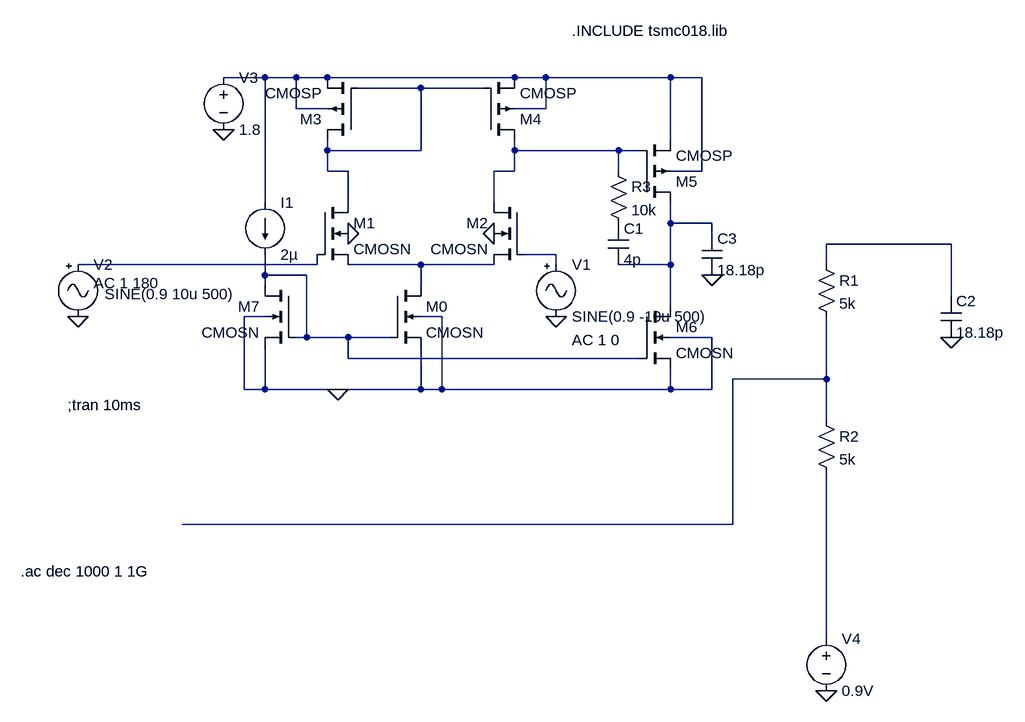
[diagram p0: schematic 2_OTA.asc]
2_OTA.asc, the LTspice schematic file:
Version 4
SHEET 1 1088 804
WIRE -64 -160 -128 -160
WIRE -16 -160 -64 -160
WIRE 32 -160 -16 -160
WIRE 320 -160 32 -160
WIRE 368 -160 320 -160
WIRE 560 -160 368 -160
WIRE 608 -160 560 -160
WIRE 176 -144 80 -144
WIRE 272 -144 176 -144
WIRE -16 -112 -16 -160
WIRE 32 -112 -16 -112
WIRE 368 -112 368 -160
WIRE 368 -112 320 -112
WIRE 560 -64 560 -160
WIRE 32 -48 32 -64
WIRE 176 -48 176 -144
WIRE 176 -48 32 -48
WIRE 320 -48 320 -64
WIRE 480 -48 320 -48
WIRE 512 -48 480 -48
WIRE 32 -16 32 -48
WIRE 64 -16 32 -16
WIRE 320 -16 320 -48
WIRE 320 -16 288 -16
WIRE 480 -16 480 -48
WIRE 608 -16 608 -160
WIRE 608 -16 560 -16
WIRE -64 32 -64 -160
WIRE 64 32 64 -16
WIRE 288 32 288 -16
WIRE 560 64 560 32
WIRE 624 64 560 64
WIRE 624 80 624 64
WIRE 992 96 800 96
WIRE 384 112 336 112
WIRE 16 128 16 112
WIRE 16 128 -352 128
WIRE 176 128 64 128
WIRE 288 128 176 128
WIRE 384 128 384 112
WIRE 560 128 560 64
WIRE 560 128 480 128
WIRE 800 128 800 96
WIRE -64 144 -64 112
WIRE 0 144 -64 144
WIRE -64 160 -64 144
WIRE 176 160 176 128
WIRE 992 176 992 96
WIRE 560 192 560 128
WIRE -64 208 -96 208
WIRE 208 208 176 208
WIRE 0 240 0 144
WIRE 0 240 -16 240
WIRE 64 240 0 240
WIRE 128 240 64 240
WIRE 624 240 560 240
WIRE 64 272 64 240
WIRE 512 272 64 272
WIRE 800 304 800 208
WIRE 800 304 656 304
WIRE -96 320 -96 208
WIRE -64 320 -64 256
WIRE -64 320 -96 320
WIRE 48 320 -64 320
WIRE 176 320 176 256
WIRE 176 320 48 320
WIRE 208 320 208 208
WIRE 208 320 176 320
WIRE 560 320 560 288
WIRE 560 320 208 320
WIRE 624 320 624 240
WIRE 624 320 560 320
WIRE 800 368 800 304
WIRE 656 528 656 304
WIRE 656 528 -192 528
WIRE 800 704 800 448
FLAG 48 320 0
FLAG 64 80 0
FLAG 288 80 0
FLAG -352 208 0
FLAG 384 208 0
FLAG -128 -80 0
FLAG 800 784 0
FLAG 992 240 0
FLAG 624 144 0
SYMBOL cmosn -16 160 M0
SYMATTR InstName M7
SYMATTR Value2 l=1u w=2u
SYMBOL cmosn 336 32 M0
SYMATTR InstName M2
SYMATTR Value2 l=1u w=2.1739u
SYMBOL cmosn 16 32 R0
SYMATTR InstName M1
SYMATTR Value2 l=1u w=2.1739u
SYMBOL cmosp 272 -64 M180
SYMATTR InstName M4
SYMATTR Value2 l=1u w=1.314u
SYMBOL cmosp 80 -64 R180
SYMATTR InstName M3
SYMATTR Value2 l=1u w=1.314u
SYMBOL current -64 32 R0
WINDOW 123 0 0 Left 2
WINDOW 39 0 0 Left 2
SYMATTR InstName I1
SYMATTR Value 2µ
SYMBOL Misc\\signal -352 112 R0
WINDOW 3 41 61 Left 2
WINDOW 123 24 44 Left 2
WINDOW 39 0 0 Left 2
SYMATTR Value SINE(0.9 10u 500)
SYMATTR Value2 AC 1 180
SYMATTR InstName V2
SYMBOL cmosn 512 192 R0
SYMATTR InstName M6
SYMATTR Value2 l=1u w=80u
SYMBOL cmosp 512 32 M180
SYMATTR InstName M5
SYMATTR Value2 l=1u w=10.512u
SYMBOL Misc\\signal 384 112 R0
WINDOW 123 24 132 Left 2
WINDOW 39 0 0 Left 2
SYMATTR Value2 AC 1 0
SYMATTR InstName V1
SYMATTR Value SINE(0.9 -10u 500)
SYMBOL voltage -128 -176 R0
WINDOW 123 0 0 Left 2
WINDOW 39 0 0 Left 2
SYMATTR InstName V3
SYMATTR Value 1.8
SYMBOL res 784 112 R0
SYMATTR InstName R1
SYMATTR Value 5k
SYMBOL res 784 352 R0
SYMATTR InstName R2
SYMATTR Value 5k
SYMBOL voltage 800 688 R0
WINDOW 123 0 0 Left 2
WINDOW 39 0 0 Left 2
SYMATTR InstName V4
SYMATTR Value 0.9V
SYMBOL cap 976 176 R0
SYMATTR InstName C2
SYMATTR Value 18.18p
SYMBOL cap 608 80 R0
SYMATTR InstName C3
SYMATTR Value 18.18p
SYMBOL res 464 -32 R0
SYMATTR InstName R3
SYMATTR Value 10k
SYMBOL cap 464 64 R0
SYMATTR InstName C1
SYMATTR Value 4p
SYMBOL cmosn 128 160 R0
SYMATTR InstName M0
SYMATTR Value2 l=1u w=20u
TEXT -368 344 Left 2 !;tran 10ms
TEXT 408 -232 Left 2 !.INCLUDE tsmc018.lib
TEXT -440 600 Left 2 !.ac dec 1000 1 1G

The netlist it stands for:
* 2_OTA.asc
M7 N009 N009 0 0 CMOSN l=1u w=2u
M2 N003 N006 N008 0 CMOSN l=1u w=2.1739u
M1 N002 N007 N008 0 CMOSN l=1u w=2.1739u
M4 N003 N002 N001 N001 CMOSP l=1u w=1.314u
M3 N002 N002 N001 N001 CMOSP l=1u w=1.314u
I1 N001 N009 2µ
V2 N007 0 SINE(0.9 10u 500) AC 1 180
M6 N004 N009 0 0 CMOSN l=1u w=80u
M5 N004 N003 N001 N001 CMOSP l=1u w=10.512u
V1 N006 0 SINE(0.9 -10u 500) AC 1 0
V3 N001 0 1.8
R1 N005 N010 5k
R2 N010 N011 5k
V4 N011 0 0.9V
C2 N005 0 18.18p
C3 N004 0 18.18p
R3 N003 P001 10k
C1 P001 N004 4p
M0 N008 N009 0 0 CMOSN l=1u w=20u
.model NMOS NMOS
.model PMOS PMOS
.lib standard.mos
;tran 10ms
.INCLUDE tsmc018.lib
.ac dec 1000 1 1G
.backanno
.end